# Altium project StepMotorControl.PrjPcb
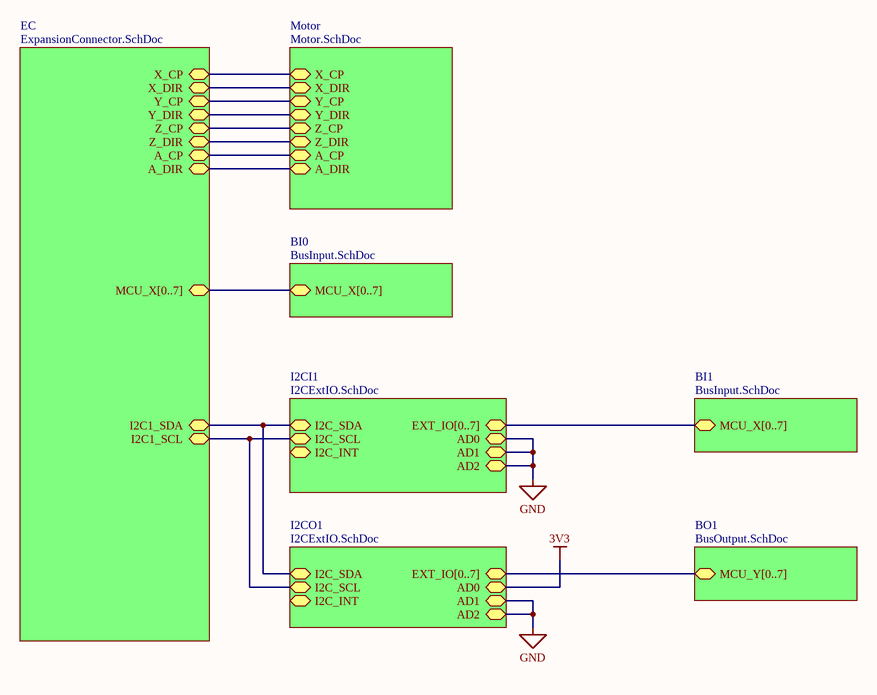
[diagram p0: Top.SchDoc]
8 sheets, 126 parts. Net scope: hierarchical (ports join the sheet entries above them; power ports are global).
Board file: SMC_V1.PcbDoc
Sheets:
  Top.SchDoc
    EC = ExpansionConnector.SchDoc
    BI0 = BusInput.SchDoc
      I0 = Input.SchDoc
      I1 = Input.SchDoc
      I2 = Input.SchDoc
      I3 = Input.SchDoc
      I4 = Input.SchDoc
      I5 = Input.SchDoc
      I6 = Input.SchDoc
      I7 = Input.SchDoc
    Motor = Motor.SchDoc
    I2CI1 = I2CExtIO.SchDoc
    BI1 = BusInput.SchDoc
      I0 = Input.SchDoc
      I1 = Input.SchDoc
      I2 = Input.SchDoc
      I3 = Input.SchDoc
      I4 = Input.SchDoc
      I5 = Input.SchDoc
      I6 = Input.SchDoc
      I7 = Input.SchDoc
    I2CO1 = I2CExtIO.SchDoc
    BO1 = BusOutput.SchDoc
      O0 = Output.SchDoc
      O1 = Output.SchDoc
      O2 = Output.SchDoc
      O3 = Output.SchDoc
      O4 = Output.SchDoc
      O5 = Output.SchDoc
      O6 = Output.SchDoc
      O7 = Output.SchDoc

## Sheet Top.SchDoc: StepMotor Controller
size A4; Organization: NTUST EE-305; Address1: No.43, Sec. 4, Keelung Rd.; Address2: Da’an Dist.; Address3: Taipei 106; Address4: Taiwan (R.O.C.); DocumentNumber: 1; Revision: 1.0; SheetNumber: 1; SheetTotal: 8

### Sub-sheets
BI0 = BusInput.SchDoc: MCU_X[0..7]
BI1 = BusInput.SchDoc: MCU_X[0..7]
BO1 = BusOutput.SchDoc: MCU_Y[0..7]
EC = ExpansionConnector.SchDoc: X_CP, X_DIR, Y_CP, Y_DIR, Z_CP, Z_DIR, A_CP, A_DIR, MCU_X[0..7], I2C1_SCL, I2C1_SDA
I2CI1 = I2CExtIO.SchDoc: EXT_IO[0..7], I2C_SCL, I2C_SDA, I2C_INT, AD0, AD1, AD2
I2CO1 = I2CExtIO.SchDoc: EXT_IO[0..7], I2C_SCL, I2C_SDA, I2C_INT, AD0, AD1, AD2
Motor = Motor.SchDoc: X_CP, X_DIR, Y_CP, Y_DIR, Z_CP, Z_DIR, A_CP, A_DIR

### Nets
GND: sheet I2CI1/AD0, sheet I2CI1/AD1, sheet I2CI1/AD2, sheet I2CO1/AD1, sheet I2CO1/AD2
A_CP: sheet EC/A_CP, sheet Motor/A_CP
A_DIR: sheet EC/A_DIR, sheet Motor/A_DIR
I2C1_SCL: sheet EC/I2C1_SCL, sheet I2CI1/I2C_SCL, sheet I2CO1/I2C_SCL
I2C1_SDA: sheet EC/I2C1_SDA, sheet I2CI1/I2C_SDA, sheet I2CO1/I2C_SDA
P1.19: sheet EC/Y_DIR, sheet Motor/Y_DIR
P1.20: sheet EC/Y_CP, sheet Motor/Y_CP
P1.23: sheet EC/X_DIR, sheet Motor/X_DIR
P1.24: sheet EC/X_CP, sheet Motor/X_CP
P5.0: sheet EC/Z_CP, sheet Motor/Z_CP
P5.1: sheet EC/Z_DIR, sheet Motor/Z_DIR

### Buses and harness runs
bus sheet BI0/MCU_X[0..7] = sheet EC/MCU_X[0..7]
bus sheet BI1/MCU_X[0..7] = sheet I2CI1/EXT_IO[0..7]
bus sheet BO1/MCU_Y[0..7] = sheet I2CO1/EXT_IO[0..7]

### Notes on the sheet
- Title
- Name
- Size:
- Revision:
- A4
- Date:
- Time:
- Sheet
- of

## Sheet ExpansionConnector.SchDoc: StepMotor Controller
size A4; Organization: NTUST EE-305; Address1: No.43, Sec. 4, Keelung Rd.; Address2: Da’an Dist.; Address3: Taipei 106; Address4: Taiwan (R.O.C.); DocumentNumber: 2; Revision: 1.0; SheetNumber: 2; SheetTotal: 8
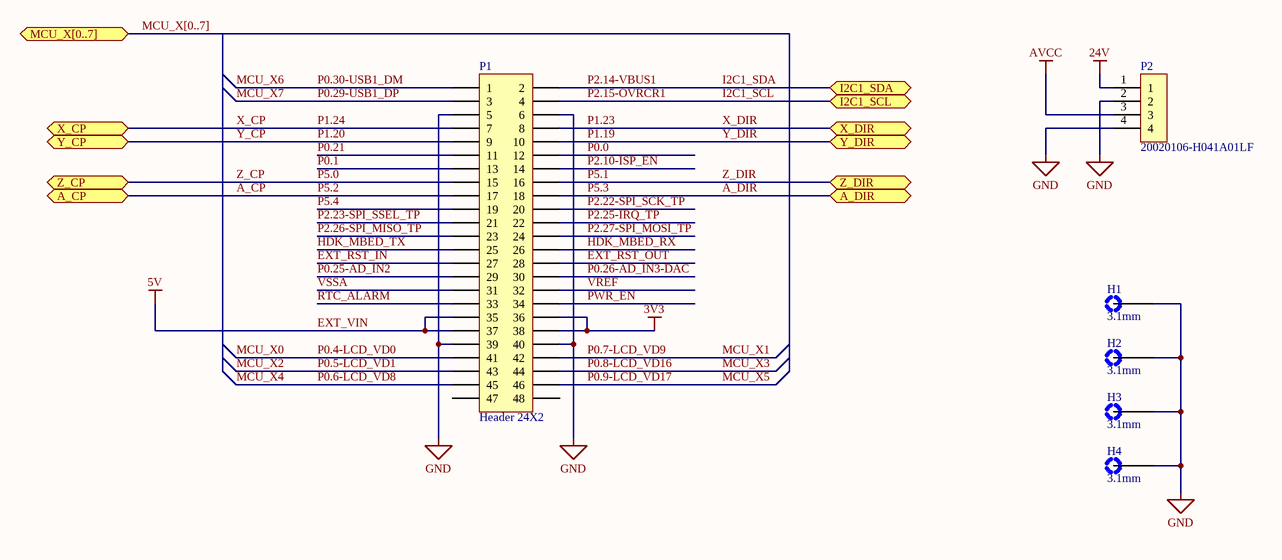
[diagram p1: ExpansionConnector.SchDoc]

### Parts
H1  3.1mm  [Holes]
H2  3.1mm  [Holes]
H3  3.1mm  [Holes]
H4  3.1mm  [Holes]
P1  Header 24X2  [HDR2X24]
P2  20020106-H041A01LF  [20020106-H041A01LF]

### Ports
A_CP, A_DIR, I2C1_SCL, I2C1_SDA, MCU_X[0..7], X_CP, X_DIR, Y_CP, Y_DIR, Z_CP, Z_DIR

### Nets
3V3: P1.36 P1.38
24V: P2.1
AVCC: P2.3
EXT_VIN: P1.35 P1.37  [also labelled 5V]
GND: H1.0 H2.0 H3.0 H4.0 P1.5 P1.6 P1.39 P1.40 P2.2 P2.4
A_CP: P1.17 ; port A_CP  [also labelled P5.2]
A_DIR: P1.18 ; port A_DIR  [also labelled P5.3]
EXT_RST_IN: P1.27
EXT_RST_OUT: P1.28
HDK_MBED_RX: P1.26
HDK_MBED_TX: P1.25
I2C1_SCL: P1.4 ; port I2C1_SCL  [also labelled P2.15-OVRCR1]
I2C1_SDA: P1.2 ; port I2C1_SDA  [also labelled P2.14-VBUS1]
MCU_X0: P1.41  [also labelled P0.4-LCD_VD0]
MCU_X1: P1.42  [also labelled P0.7-LCD_VD9]
MCU_X2: P1.43  [also labelled P0.5-LCD_VD1]
MCU_X3: P1.44  [also labelled P0.8-LCD_VD16]
MCU_X4: P1.45  [also labelled P0.6-LCD_VD8]
MCU_X5: P1.46  [also labelled P0.9-LCD_VD17]
MCU_X6: P1.1  [also labelled P0.30-USB1_DM]
MCU_X7: P1.3  [also labelled P0.29-USB1_DP]
P0.0: P1.12
P0.1: P1.13
P0.21: P1.11
P0.25-AD_IN2: P1.29
P0.26-AD_IN3-DAC: P1.30
P1.19: P1.10 ; port Y_DIR  [also labelled Y_DIR]
P1.20: P1.9 ; port Y_CP  [also labelled Y_CP]
P1.23: P1.8 ; port X_DIR  [also labelled X_DIR]
P1.24: P1.7 ; port X_CP  [also labelled X_CP]
P2.10-ISP_EN: P1.14
P2.22-SPI_SCK_TP: P1.20
P2.23-SPI_SSEL_TP: P1.21
P2.25-IRQ_TP: P1.22
P2.26-SPI_MISO_TP: P1.23
P2.27-SPI_MOSI_TP: P1.24
P5.0: P1.15 ; port Z_CP  [also labelled Z_CP]
P5.1: P1.16 ; port Z_DIR  [also labelled Z_DIR]
P5.4: P1.19
PWR_EN: P1.34
RTC_ALARM: P1.33
VREF: P1.32
VSSA: P1.31

Not connected (* = marked no-connect by the designer): P1 47 48

### Buses and harness runs
bus MCU_X[0..7] = port MCU_X[0..7]

### Notes on the sheet
- Title
- Name
- Size:
- Revision:
- A4
- Date:
- Time:
- Sheet
- of

### Library data of the parts
H1-H4 = Holes: Mounting Holes
P1 = Header 24X2: Header, 24-Pin, Dual row; LatestRevisionDate: 17-Jul-2002; LatestRevisionNote: Re-released for DXP Platform.; Publisher: Altium Limited
P2 = Amphenol FCI: TERM BLOCK HDR 4POS VERT 5.08MM

## Sheet BusInput.SchDoc: StepMotor Controller
size A4; Organization: NTUST EE-305; Address1: No.43, Sec. 4, Keelung Rd.; Address2: Da’an Dist.; Address3: Taipei 106; Address4: Taiwan (R.O.C.); DocumentNumber: 5; Revision: 1.0; SheetNumber: 5; SheetTotal: 8
Used 2 times, as channels BI0, BI1. Parts and nets are listed once, with the designators drawn on the sheet.
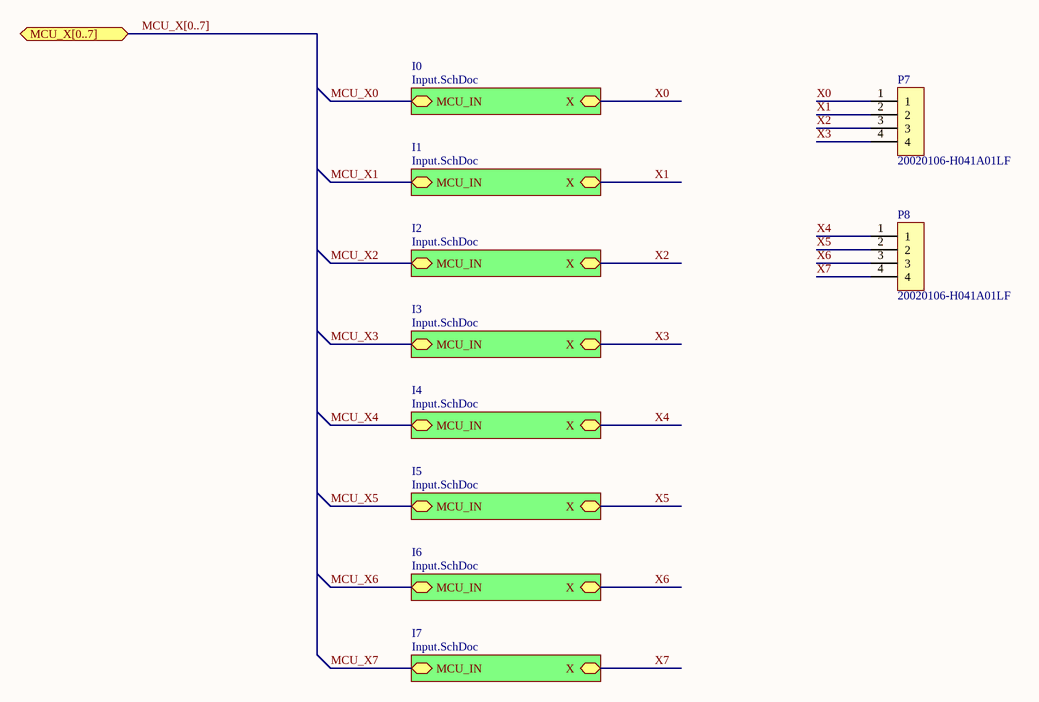
[diagram p2: BusInput.SchDoc]

### Parts
P7  20020106-H041A01LF  [20020106-H041A01LF]
P8  20020106-H041A01LF  [20020106-H041A01LF]

### Sub-sheets
I0 = Input.SchDoc: MCU_IN, X
I1 = Input.SchDoc: MCU_IN, X
I2 = Input.SchDoc: MCU_IN, X
I3 = Input.SchDoc: MCU_IN, X
I4 = Input.SchDoc: MCU_IN, X
I5 = Input.SchDoc: MCU_IN, X
I6 = Input.SchDoc: MCU_IN, X
I7 = Input.SchDoc: MCU_IN, X

### Ports
MCU_X[0..7]

### Nets
X0: P7.1 ; sheet I0/X
X1: P7.2 ; sheet I1/X
X2: P7.3 ; sheet I2/X
X3: P7.4 ; sheet I3/X
X4: P8.1 ; sheet I4/X
X5: P8.2 ; sheet I5/X
X6: P8.3 ; sheet I6/X
X7: P8.4 ; sheet I7/X

### Channels
BI0: designators end in _BI0
BI1: designators end in _BI1

### Buses and harness runs
bus MCU_X[0..7] = port MCU_X[0..7]

### Notes on the sheet
- Title
- Name
- Size:
- Revision:
- A4
- Date:
- Time:
- Sheet
- of

### Library data of the parts
P7 P8 = Amphenol FCI: TERM BLOCK HDR 4POS VERT 5.08MM

## Sheet Input.SchDoc: StepMotor Controller
size A4; Organization: NTUST EE-305; Address1: No.43, Sec. 4, Keelung Rd.; Address2: Da’an Dist.; Address3: Taipei 106; Address4: Taiwan (R.O.C.); DocumentNumber: 6; Revision: 1.0; SheetNumber: 6; SheetTotal: 8
Used 16 times, as channels BI0/I0, BI0/I1, BI0/I2, BI0/I3, BI0/I4, BI0/I5, BI0/I6, BI0/I7, BI1/I0, BI1/I1, BI1/I2, BI1/I3, BI1/I4, BI1/I5, BI1/I6, BI1/I7. Parts and nets are listed once, with the designators drawn on the sheet.
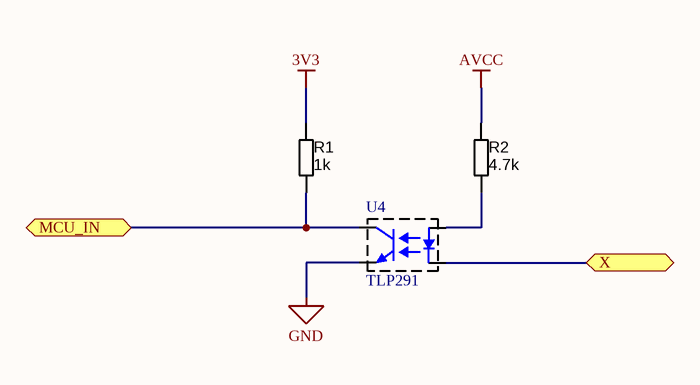
[diagram p3: Input.SchDoc]

### Parts
R1  1k  [RESC1608N]
R2  4.7k  [RESC1608N]
U4  TLP291  [SO4_N]

### Ports
MCU_IN, X

### Nets
3V3: R1.1
AVCC: R2.1
GND: U4.3(EMITTER)
MCU_IN: R1.2 U4.4(COLLECTOR) ; port MCU_IN
X: U4.2(CATHODE) ; port X
NetR2_2: R2.2 U4.1(ANODE)

### Channels
BI0/I0: designators end in _I01; ports MCU_IN=MCU_X0 X=X0_BI0
BI0/I1: designators end in _I11; ports MCU_IN=MCU_X1 X=X1_BI0
BI0/I2: designators end in _I21; ports MCU_IN=MCU_X2 X=X2_BI0
BI0/I3: designators end in _I31; ports MCU_IN=MCU_X3 X=X3_BI0
BI0/I4: designators end in _I41; ports MCU_IN=MCU_X4 X=X4_BI0
BI0/I5: designators end in _I51; ports MCU_IN=MCU_X5 X=X5_BI0
BI0/I6: designators end in _I61; ports MCU_IN=MCU_X6 X=X6_BI0
BI0/I7: designators end in _I71; ports MCU_IN=MCU_X7 X=X7_BI0
BI1/I0: designators end in _I02; ports MCU_IN=EXT_IO0 X=X0_BI1
BI1/I1: designators end in _I12; ports MCU_IN=EXT_IO1 X=X1_BI1
BI1/I2: designators end in _I22; ports MCU_IN=EXT_IO2 X=X2_BI1
BI1/I3: designators end in _I32; ports MCU_IN=EXT_IO3 X=X3_BI1
BI1/I4: designators end in _I42; ports MCU_IN=EXT_IO4 X=X4_BI1
BI1/I5: designators end in _I52; ports MCU_IN=EXT_IO5 X=X5_BI1
BI1/I6: designators end in _I62; ports MCU_IN=EXT_IO6 X=X6_BI1
BI1/I7: designators end in _I72; ports MCU_IN=EXT_IO7 X=X7_BI1

### Notes on the sheet
- Title
- Name
- Size:
- Revision:
- A4
- Date:
- Time:
- Sheet
- of

### Library data of the parts
R1 R2 = Resistor SMD chip: Manufacturer 1: Yageo; Manufacturer Part Number 1: RC0805JR-0710KL; Ratings: 1/8 W; Tolerance: ?%; Package / Case: 0805 (2012 metric); Material: Thick Film; Supplier 1: Digi-Key; Supplier Part Number 1: 311-10KARCT-ND
  R1: Value: 1k
  R2: Value: 4.7k
U4 = TLP291: Optoisolator Transistor Output 3750Vrms 1 Channel 4-SO

## Sheet Motor.SchDoc: StepMotor Controller
size A4; Organization: NTUST EE-305; Address1: No.43, Sec. 4, Keelung Rd.; Address2: Da’an Dist.; Address3: Taipei 106; Address4: Taiwan (R.O.C.); DocumentNumber: 3; Revision: 1.0; SheetNumber: 3; SheetTotal: 8
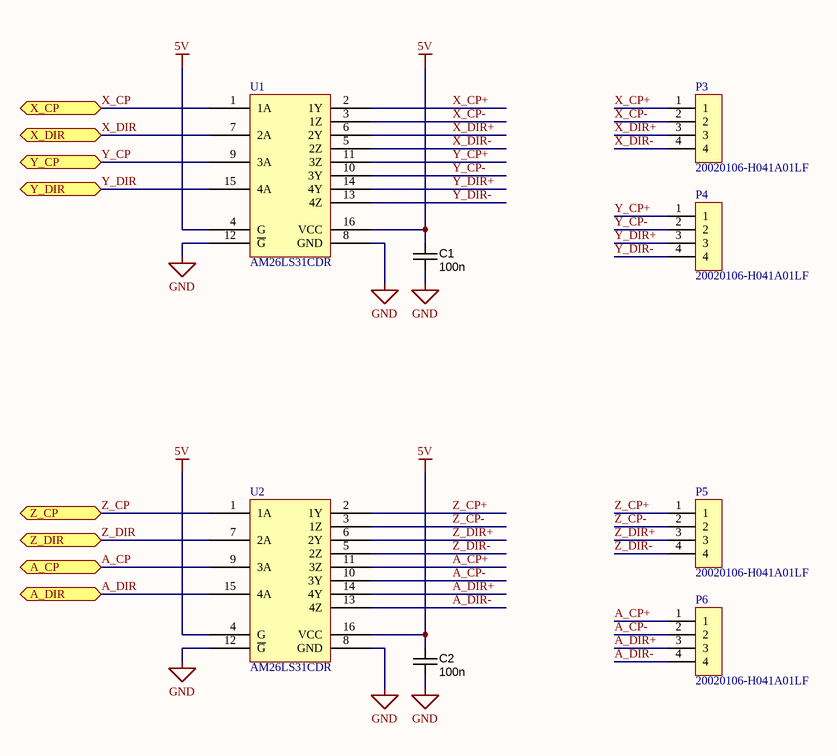
[diagram p4: Motor.SchDoc]

### Parts
C1  100n  [CAPC1608N]
C2  100n  [CAPC1608N]
P3  20020106-H041A01LF  [20020106-H041A01LF]
P4  20020106-H041A01LF  [20020106-H041A01LF]
P5  20020106-H041A01LF  [20020106-H041A01LF]
P6  20020106-H041A01LF  [20020106-H041A01LF]
U1  AM26LS31CDR  [SOIC16_N]
U2  AM26LS31CDR  [SOIC16_N]

### Ports
A_CP, A_DIR, X_CP, X_DIR, Y_CP, Y_DIR, Z_CP, Z_DIR

### Nets
5V: C1.1 C2.1 U1.4(G) U1.16(VCC) U2.4(G) U2.16(VCC)  [project net EXT_VIN]
GND: C1.2 C2.2 U1.8(GND) U1.12(~{G}) U2.8(GND) U2.12(~{G})
A_CP: U2.9(3A) ; port A_CP
A_CP+: P6.1 U2.11(3Z)
A_CP-: P6.2 U2.10(3Y)
A_DIR: U2.15(4A) ; port A_DIR
A_DIR+: P6.3 U2.14(4Y)
A_DIR-: P6.4 U2.13(4Z)
X_CP: U1.1(1A) ; port X_CP  [project net P1.24]
X_CP+: P3.1 U1.2(1Y)
X_CP-: P3.2 U1.3(1Z)
X_DIR: U1.7(2A) ; port X_DIR  [project net P1.23]
X_DIR+: P3.3 U1.6(2Y)
X_DIR-: P3.4 U1.5(2Z)
Y_CP: U1.9(3A) ; port Y_CP  [project net P1.20]
Y_CP+: P4.1 U1.11(3Z)
Y_CP-: P4.2 U1.10(3Y)
Y_DIR: U1.15(4A) ; port Y_DIR  [project net P1.19]
Y_DIR+: P4.3 U1.14(4Y)
Y_DIR-: P4.4 U1.13(4Z)
Z_CP: U2.1(1A) ; port Z_CP  [project net P5.0]
Z_CP+: P5.1 U2.2(1Y)
Z_CP-: P5.2 U2.3(1Z)
Z_DIR: U2.7(2A) ; port Z_DIR  [project net P5.1]
Z_DIR+: P5.3 U2.6(2Y)
Z_DIR-: P5.4 U2.5(2Z)

### Notes on the sheet
- Title
- Name
- Size:
- Revision:
- A4
- Date:
- Time:
- Sheet
- of

### Library data of the parts
C1 C2 = Capacitor SMD Cer X7R: Manufacturer 1: Kemet; Manufacturer Part Number 1: C0805C104K5RACTU; Tolerance: ?0%; Ratings: 50V; X7R; Material: ceramic; Package / Case: 0805 (2012 metric); Supplier 1: Digi-Key; Supplier Part Number 1: 399-1170-1-ND; Value: 100n
P3-P6 = Amphenol FCI: TERM BLOCK HDR 4POS VERT 5.08MM
U1 U2 = AM26LS31C: IC QUAD DIFF LINE DRIVER 16-SOIC

## Sheet I2CExtIO.SchDoc: StepMotor Controller
size A4; Organization: NTUST EE-305; Address1: No.43, Sec. 4, Keelung Rd.; Address2: Da’an Dist.; Address3: Taipei 106; Address4: Taiwan (R.O.C.); DocumentNumber: 4; Revision: 1.0; SheetNumber: 4; SheetTotal: 8
Used 2 times, as channels I2CI1, I2CO1. Parts and nets are listed once, with the designators drawn on the sheet.
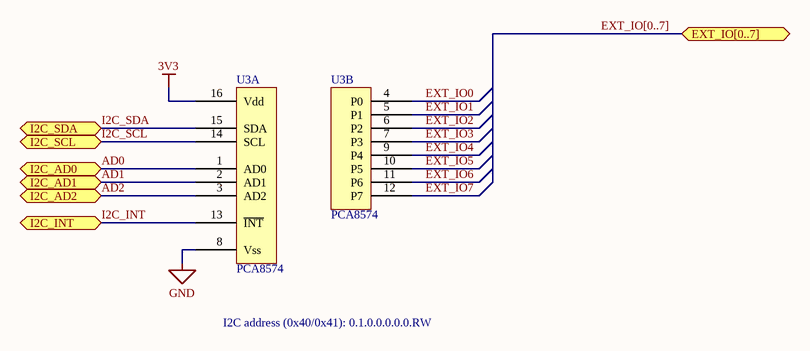
[diagram p5: I2CExtIO.SchDoc]

### Parts
U3  PCA8574  [TSSOP-ST16_N]  (parts A,B of 2)

### Ports
EXT_IO[0..7], I2C_AD0, I2C_AD1, I2C_AD2, I2C_INT, I2C_SCL, I2C_SDA

### Nets
3V3: U3.16(Vdd)
GND: U3.8(Vss)
AD0: U3.1(AD0) ; port I2C_AD0
AD1: U3.2(AD1) ; port I2C_AD1
AD2: U3.3(AD2) ; port I2C_AD2
EXT_IO0: U3.4(P0)
EXT_IO1: U3.5(P1)
EXT_IO2: U3.6(P2)
EXT_IO3: U3.7(P3)
EXT_IO4: U3.9(P4)
EXT_IO5: U3.10(P5)
EXT_IO6: U3.11(P6)
EXT_IO7: U3.12(P7)
I2C_INT: U3.13(~{INT}) ; port I2C_INT
I2C_SCL: U3.14(SCL) ; port I2C_SCL
I2C_SDA: U3.15(SDA) ; port I2C_SDA

### Channels
I2CI1: designators end in _I2CI1; ports I2C_AD0=AD0_I2CI1 I2C_AD1=AD1_I2CI1 I2C_AD2=AD2_I2CI1 I2C_INT=I2C_INT_I2CI1 I2C_SCL=I2C1_SCL I2C_SDA=I2C1_SDA
I2CO1: designators end in _I2CO1; ports I2C_AD0=AD0_I2CO1 I2C_AD1=AD1_I2CO1 I2C_AD2=AD2_I2CO1 I2C_INT=I2C_INT_I2CO1 I2C_SCL=I2C1_SCL I2C_SDA=I2C1_SDA

### Buses and harness runs
bus EXT_IO[0..7] = port EXT_IO[0..7]

### Notes on the sheet
- I2C address (0x40/0x41): 0.1.0.0.0.0.0.RW
- Title
- Name
- Size:
- Revision:
- A4
- Date:
- Time:
- Sheet
- of

### Library data of the parts
U3 = PCA8574: Remote 8-bit I/O expander for I2C-bus with interrupt; Supplier 1: Digi-Key; Supplier Part Number 1: 568-4241-5-ND

## Sheet BusOutput.SchDoc: StepMotor Controller
size A4; Organization: NTUST EE-305; Address1: No.43, Sec. 4, Keelung Rd.; Address2: Da’an Dist.; Address3: Taipei 106; Address4: Taiwan (R.O.C.); DocumentNumber: 7; Revision: 1.0; SheetNumber: 7; SheetTotal: 8
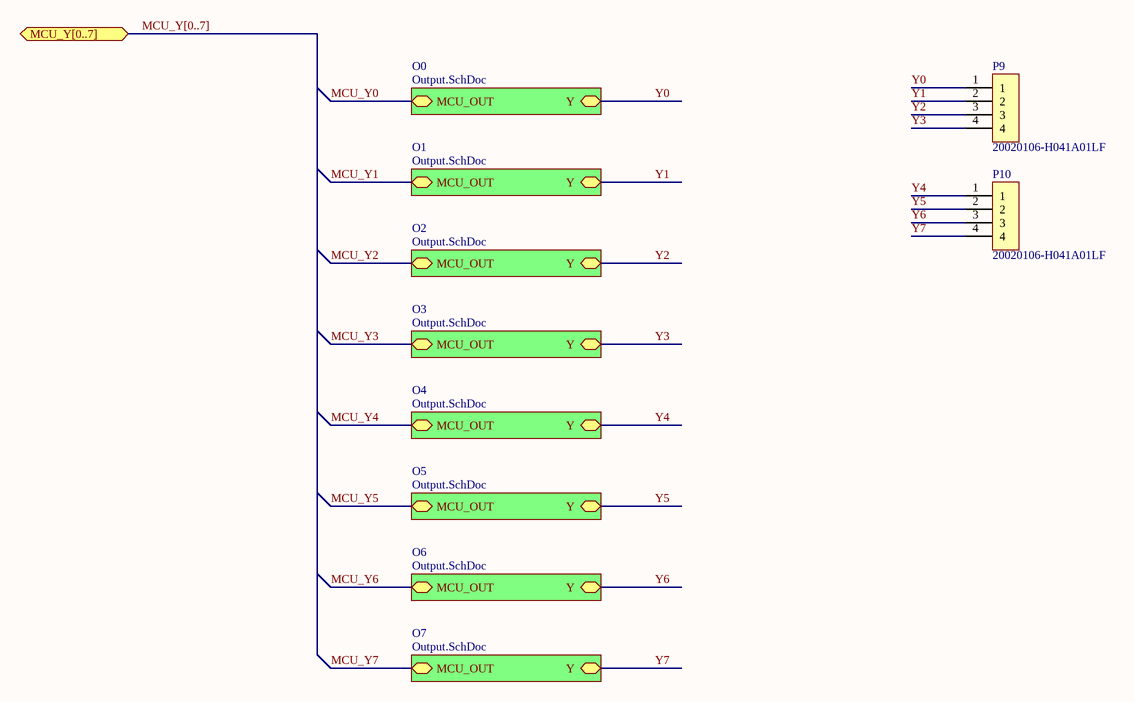
[diagram p6: BusOutput.SchDoc]

### Parts
P9  20020106-H041A01LF  [20020106-H041A01LF]
P10  20020106-H041A01LF  [20020106-H041A01LF]

### Sub-sheets
O0 = Output.SchDoc: MCU_OUT, Y
O1 = Output.SchDoc: MCU_OUT, Y
O2 = Output.SchDoc: MCU_OUT, Y
O3 = Output.SchDoc: MCU_OUT, Y
O4 = Output.SchDoc: MCU_OUT, Y
O5 = Output.SchDoc: MCU_OUT, Y
O6 = Output.SchDoc: MCU_OUT, Y
O7 = Output.SchDoc: MCU_OUT, Y

### Ports
MCU_Y[0..7]

### Nets
Y0: P9.1 ; sheet O0/Y
Y1: P9.2 ; sheet O1/Y
Y2: P9.3 ; sheet O2/Y
Y3: P9.4 ; sheet O3/Y
Y4: P10.1 ; sheet O4/Y
Y5: P10.2 ; sheet O5/Y
Y6: P10.3 ; sheet O6/Y
Y7: P10.4 ; sheet O7/Y

### Buses and harness runs
bus MCU_Y[0..7] = port MCU_Y[0..7]

### Notes on the sheet
- Title
- Name
- Size:
- Revision:
- A4
- Date:
- Time:
- Sheet
- of

### Library data of the parts
P9 P10 = Amphenol FCI: TERM BLOCK HDR 4POS VERT 5.08MM

## Sheet Output.SchDoc: StepMotor Controller
size A4; Organization: NTUST EE-305; Address1: No.43, Sec. 4, Keelung Rd.; Address2: Da’an Dist.; Address3: Taipei 106; Address4: Taiwan (R.O.C.); DocumentNumber: 8; Revision: 1.0; SheetNumber: 8; SheetTotal: 8
Used 8 times, as channels BO1/O0, BO1/O1, BO1/O2, BO1/O3, BO1/O4, BO1/O5, BO1/O6, BO1/O7. Parts and nets are listed once, with the designators drawn on the sheet.
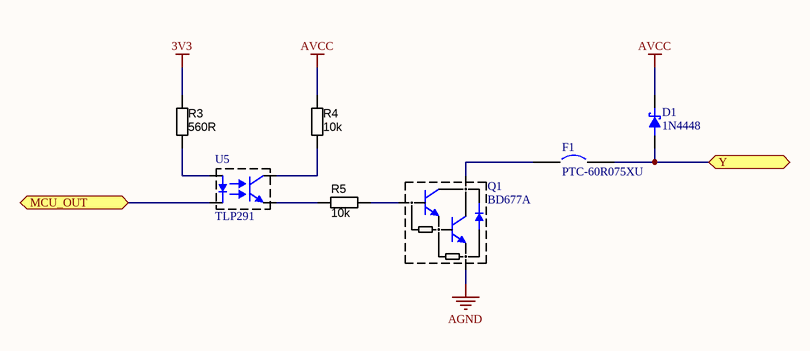
[diagram p7: Output.SchDoc]

### Parts
D1  1N4448  [SOD323]
F1  PTC-60R075XU  [SPST-60R075XU]
Q1  BD677A  [TO-126]
R3  560R  [RESC1608N]
R4  10k  [RESC1608N]
R5  10k  [RESC1608N]
U5  TLP291  [SO4_N]

### Ports
MCU_OUT, Y

### Nets
3V3: R3.1
AGND: Q1.3(E)
AVCC: D1.1(cathode) R4.1
MCU_OUT: U5.2(CATHODE) ; port MCU_OUT
Y: D1.2(anode) F1.2 ; port Y
NetF1_1: F1.1 Q1.2(C)
NetQ1_1: Q1.1(B) R5.2
NetR3_2: R3.2 U5.1(ANODE)
NetR4_2: R4.2 U5.4(COLLECTOR)
NetR5_1: R5.1 U5.3(EMITTER)

### Channels
BO1/O0: designators end in _O0; ports MCU_OUT=EXT_IO0 Y=Y0
BO1/O1: designators end in _O1; ports MCU_OUT=EXT_IO1 Y=Y1
BO1/O2: designators end in _O2; ports MCU_OUT=EXT_IO2 Y=Y2
BO1/O3: designators end in _O3; ports MCU_OUT=EXT_IO3 Y=Y3
BO1/O4: designators end in _O4; ports MCU_OUT=EXT_IO4 Y=Y4
BO1/O5: designators end in _O5; ports MCU_OUT=EXT_IO5 Y=Y5
BO1/O6: designators end in _O6; ports MCU_OUT=EXT_IO6 Y=Y6
BO1/O7: designators end in _O7; ports MCU_OUT=EXT_IO7 Y=Y7

### Notes on the sheet
- Title
- Name
- Size:
- Revision:
- A4
- Date:
- Time:
- Sheet
- of

### Library data of the parts
D1 = 1N4448: SURFACE MOUNT FAST SWITCHING DIODE; Supplier 1: Digi-Key; Supplier Part Number 1: 1N4448HWS-FDICT-ND
F1 = PTC-60R075XU: PTC .75A 60V RESETTABLE KINK; Published: 24-Mar-1999; LatestRevisionDate: 17-Jul-2002; LatestRevisionNote: Re-released for DXP Platform.; PackageReference: SPST-2; Publisher: Altium Limited; PackageDescription: Switch; 2 Leads; Supplier 1: Digikey; Supplier Part Number 1: F1922-ND
Q1 = BD677A: Bipolar (BJT) Transistor NPN - Darlington 60V 4A 40W Through Hole SOT-32-3; Supplier 1: Digi-Key; Supplier Part Number 1: 497-2600-5-ND
R3-R5 = Resistor SMD chip: as R1 on sheet Input; Package / Case: 0805 (2012 metric); Material: Thick Film; Supplier 1: Digi-Key; Supplier Part Number 1: 311-10KARCT-ND
  R3: Value: 560R
  R4 R5: Value: 10k
U5 = TLP291: as U4 on sheet Input

## Nets that join several sheets
3V3: ExpansionConnector (P1.36 P1.38), BI0/I0 (R1_I01.1), BI0/I1 (R1_I11.1), BI0/I2 (R1_I21.1), BI0/I3 (R1_I31.1), BI0/I4 (R1_I41.1), BI0/I5 (R1_I51.1), BI0/I6 (R1_I61.1), BI0/I7 (R1_I71.1), I2CI1 (U3_I2CI1.16), BI1/I0 (R1_I02.1), BI1/I1 (R1_I12.1), BI1/I2 (R1_I22.1), BI1/I3 (R1_I32.1), BI1/I4 (R1_I42.1), BI1/I5 (R1_I52.1), BI1/I6 (R1_I62.1), BI1/I7 (R1_I72.1), I2CO1 (U3_I2CO1.16), BO1/O0 (R3_O0.1), BO1/O1 (R3_O1.1), BO1/O2 (R3_O2.1), BO1/O3 (R3_O3.1), BO1/O4 (R3_O4.1), BO1/O5 (R3_O5.1), BO1/O6 (R3_O6.1), BO1/O7 (R3_O7.1)
AGND: BO1/O0 (Q1_O0.3), BO1/O1 (Q1_O1.3), BO1/O2 (Q1_O2.3), BO1/O3 (Q1_O3.3), BO1/O4 (Q1_O4.3), BO1/O5 (Q1_O5.3), BO1/O6 (Q1_O6.3), BO1/O7 (Q1_O7.3)
AVCC: ExpansionConnector (P2.3), BI0/I0 (R2_I01.1), BI0/I1 (R2_I11.1), BI0/I2 (R2_I21.1), BI0/I3 (R2_I31.1), BI0/I4 (R2_I41.1), BI0/I5 (R2_I51.1), BI0/I6 (R2_I61.1), BI0/I7 (R2_I71.1), BI1/I0 (R2_I02.1), BI1/I1 (R2_I12.1), BI1/I2 (R2_I22.1), BI1/I3 (R2_I32.1), BI1/I4 (R2_I42.1), BI1/I5 (R2_I52.1), BI1/I6 (R2_I62.1), BI1/I7 (R2_I72.1), BO1/O0 (D1_O0.1 R4_O0.1), BO1/O1 (D1_O1.1 R4_O1.1), BO1/O2 (D1_O2.1 R4_O2.1), BO1/O3 (D1_O3.1 R4_O3.1), BO1/O4 (D1_O4.1 R4_O4.1), BO1/O5 (D1_O5.1 R4_O5.1), BO1/O6 (D1_O6.1 R4_O6.1), BO1/O7 (D1_O7.1 R4_O7.1)
EXT_VIN: ExpansionConnector (P1.35 P1.37), Motor (6 pins)
GND: ExpansionConnector (10 pins), BI0/I0 (U4_I01.3), BI0/I1 (U4_I11.3), BI0/I2 (U4_I21.3), BI0/I3 (U4_I31.3), BI0/I4 (U4_I41.3), BI0/I5 (U4_I51.3), BI0/I6 (U4_I61.3), BI0/I7 (U4_I71.3), Motor (6 pins), I2CI1 (U3_I2CI1.8), BI1/I0 (U4_I02.3), BI1/I1 (U4_I12.3), BI1/I2 (U4_I22.3), BI1/I3 (U4_I32.3), BI1/I4 (U4_I42.3), BI1/I5 (U4_I52.3), BI1/I6 (U4_I62.3), BI1/I7 (U4_I72.3), I2CO1 (U3_I2CO1.8)
A_CP: ExpansionConnector (P1.17), Motor (U2.9)
A_DIR: ExpansionConnector (P1.18), Motor (U2.15)
EXT_IO0: I2CI1 (U3_I2CI1.4), BI1/I0 (R1_I02.2 U4_I02.4)
EXT_IO0: I2CO1 (U3_I2CO1.4), BO1/O0 (U5_O0.2)
EXT_IO1: I2CI1 (U3_I2CI1.5), BI1/I1 (R1_I12.2 U4_I12.4)
EXT_IO1: I2CO1 (U3_I2CO1.5), BO1/O1 (U5_O1.2)
EXT_IO2: I2CI1 (U3_I2CI1.6), BI1/I2 (R1_I22.2 U4_I22.4)
EXT_IO2: I2CO1 (U3_I2CO1.6), BO1/O2 (U5_O2.2)
EXT_IO3: I2CI1 (U3_I2CI1.7), BI1/I3 (R1_I32.2 U4_I32.4)
EXT_IO3: I2CO1 (U3_I2CO1.7), BO1/O3 (U5_O3.2)
EXT_IO4: I2CI1 (U3_I2CI1.9), BI1/I4 (R1_I42.2 U4_I42.4)
EXT_IO4: I2CO1 (U3_I2CO1.9), BO1/O4 (U5_O4.2)
EXT_IO5: I2CI1 (U3_I2CI1.10), BI1/I5 (R1_I52.2 U4_I52.4)
EXT_IO5: I2CO1 (U3_I2CO1.10), BO1/O5 (U5_O5.2)
EXT_IO6: I2CI1 (U3_I2CI1.11), BI1/I6 (R1_I62.2 U4_I62.4)
EXT_IO6: I2CO1 (U3_I2CO1.11), BO1/O6 (U5_O6.2)
EXT_IO7: I2CI1 (U3_I2CI1.12), BI1/I7 (R1_I72.2 U4_I72.4)
EXT_IO7: I2CO1 (U3_I2CO1.12), BO1/O7 (U5_O7.2)
I2C1_SCL: ExpansionConnector (P1.4), I2CI1 (U3_I2CI1.14), I2CO1 (U3_I2CO1.14)
I2C1_SDA: ExpansionConnector (P1.2), I2CI1 (U3_I2CI1.15), I2CO1 (U3_I2CO1.15)
MCU_X0: ExpansionConnector (P1.41), BI0/I0 (R1_I01.2 U4_I01.4)
MCU_X1: ExpansionConnector (P1.42), BI0/I1 (R1_I11.2 U4_I11.4)
MCU_X2: ExpansionConnector (P1.43), BI0/I2 (R1_I21.2 U4_I21.4)
MCU_X3: ExpansionConnector (P1.44), BI0/I3 (R1_I31.2 U4_I31.4)
MCU_X4: ExpansionConnector (P1.45), BI0/I4 (R1_I41.2 U4_I41.4)
MCU_X5: ExpansionConnector (P1.46), BI0/I5 (R1_I51.2 U4_I51.4)
MCU_X6: ExpansionConnector (P1.1), BI0/I6 (R1_I61.2 U4_I61.4)
MCU_X7: ExpansionConnector (P1.3), BI0/I7 (R1_I71.2 U4_I71.4)
P1.19: ExpansionConnector (P1.10), Motor (U1.15)
P1.20: ExpansionConnector (P1.9), Motor (U1.9)
P1.23: ExpansionConnector (P1.8), Motor (U1.7)
P1.24: ExpansionConnector (P1.7), Motor (U1.1)
P5.0: ExpansionConnector (P1.15), Motor (U2.1)
P5.1: ExpansionConnector (P1.16), Motor (U2.7)
X0_BI0: BI0 (P7_BI0.1), BI0/I0 (U4_I01.2)
X0_BI1: BI1 (P7_BI1.1), BI1/I0 (U4_I02.2)
X1_BI0: BI0 (P7_BI0.2), BI0/I1 (U4_I11.2)
X1_BI1: BI1 (P7_BI1.2), BI1/I1 (U4_I12.2)
X2_BI0: BI0 (P7_BI0.3), BI0/I2 (U4_I21.2)
X2_BI1: BI1 (P7_BI1.3), BI1/I2 (U4_I22.2)
X3_BI0: BI0 (P7_BI0.4), BI0/I3 (U4_I31.2)
X3_BI1: BI1 (P7_BI1.4), BI1/I3 (U4_I32.2)
X4_BI0: BI0 (P8_BI0.1), BI0/I4 (U4_I41.2)
X4_BI1: BI1 (P8_BI1.1), BI1/I4 (U4_I42.2)
X5_BI0: BI0 (P8_BI0.2), BI0/I5 (U4_I51.2)
X5_BI1: BI1 (P8_BI1.2), BI1/I5 (U4_I52.2)
X6_BI0: BI0 (P8_BI0.3), BI0/I6 (U4_I61.2)
X6_BI1: BI1 (P8_BI1.3), BI1/I6 (U4_I62.2)
X7_BI0: BI0 (P8_BI0.4), BI0/I7 (U4_I71.2)
X7_BI1: BI1 (P8_BI1.4), BI1/I7 (U4_I72.2)
Y0: BusOutput (P9.1), BO1/O0 (D1_O0.2 F1_O0.2)
Y1: BusOutput (P9.2), BO1/O1 (D1_O1.2 F1_O1.2)
Y2: BusOutput (P9.3), BO1/O2 (D1_O2.2 F1_O2.2)
Y3: BusOutput (P9.4), BO1/O3 (D1_O3.2 F1_O3.2)
Y4: BusOutput (P10.1), BO1/O4 (D1_O4.2 F1_O4.2)
Y5: BusOutput (P10.2), BO1/O5 (D1_O5.2 F1_O5.2)
Y6: BusOutput (P10.3), BO1/O6 (D1_O6.2 F1_O6.2)
Y7: BusOutput (P10.4), BO1/O7 (D1_O7.2 F1_O7.2)